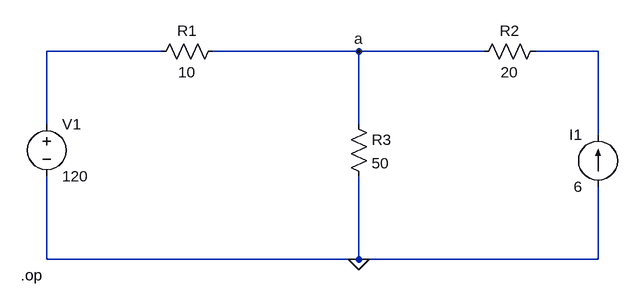
[diagram p0: schematic current.asc]
current.asc, the LTspice schematic file:
Version 4
SHEET 1 932 680
WIRE 224 16 48 16
WIRE 528 16 304 16
WIRE 720 16 528 16
WIRE 896 16 800 16
WIRE 48 128 48 16
WIRE 528 128 528 16
WIRE 896 144 896 16
WIRE 48 336 48 208
WIRE 528 336 528 208
WIRE 528 336 48 336
WIRE 896 336 896 224
WIRE 896 336 528 336
FLAG 528 336 0
FLAG 528 16 a
SYMBOL voltage 48 112 R0
WINDOW 123 0 0 Left 0
WINDOW 39 0 0 Left 0
SYMATTR InstName V1
SYMATTR Value 120
SYMBOL res 320 0 R90
WINDOW 0 0 56 VBottom 2
WINDOW 3 32 56 VTop 2
SYMATTR InstName R1
SYMATTR Value 10
SYMBOL res 816 0 R90
WINDOW 0 0 56 VBottom 2
WINDOW 3 32 56 VTop 2
SYMATTR InstName R2
SYMATTR Value 20
SYMBOL res 512 112 R0
SYMATTR InstName R3
SYMATTR Value 50
SYMBOL current 896 224 R180
WINDOW 0 24 80 Left 2
WINDOW 3 24 0 Left 2
WINDOW 123 0 0 Left 0
WINDOW 39 0 0 Left 0
SYMATTR InstName I1
SYMATTR Value 6
TEXT 8 360 Left 2 !.op

The netlist it stands for:
* current.asc
V1 N001 0 120
R1 a N001 10
R2 N002 a 20
R3 a 0 50
I1 0 N002 6
.op
.backanno
.end